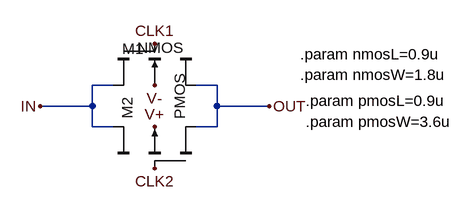
[diagram p0: schematic TransmissionGate.asc]
TransmissionGate.asc, the LTspice schematic file:
Version 4
SHEET 1 996 908
WIRE 64 144 32 144
WIRE 224 144 192 144
WIRE 32 176 32 144
WIRE 32 176 -48 176
WIRE 224 176 224 144
WIRE 304 176 224 176
WIRE 32 208 32 176
WIRE 64 208 32 208
WIRE 224 208 224 176
WIRE 224 208 192 208
FLAG -48 176 IN
FLAG 304 176 OUT
FLAG 128 144 V-
FLAG 128 208 V+
FLAG 128 80 CLK1
FLAG 128 272 CLK2
SYMBOL cktsym\\nmos4 128 144 R90
WINDOW 3 -58 -45 VRight 2
WINDOW 0 -56 16 VRight 2
SYMATTR InstName M1
SYMATTR Value2 l=nmosL w=nmosW
SYMBOL cktsym\\pmos4 128 208 R270
WINDOW 3 11 39 Left 2
WINDOW 0 12 -42 Left 2
SYMATTR InstName M2
SYMATTR Value2 l=pmosL w=pmosW
TEXT 352 96 Left 2 !.param nmosL=0.9u
TEXT 352 128 Left 2 !.param nmosW=1.8u
TEXT 360 168 Left 2 !.param pmosL=0.9u
TEXT 360 200 Left 2 !.param pmosW=3.6u

The netlist it stands for:
* TransmissionGate.asc
M1 OUT CLK1 IN V- NMOS l=nmosL w=nmosW
M2 OUT CLK2 IN V+ PMOS l=pmosL w=pmosW
.model NMOS NMOS
.model PMOS PMOS
.lib standard.mos
.param nmosL=0.9u
.param nmosW=1.8u
.param pmosL=0.9u
.param pmosW=3.6u
.backanno
.end